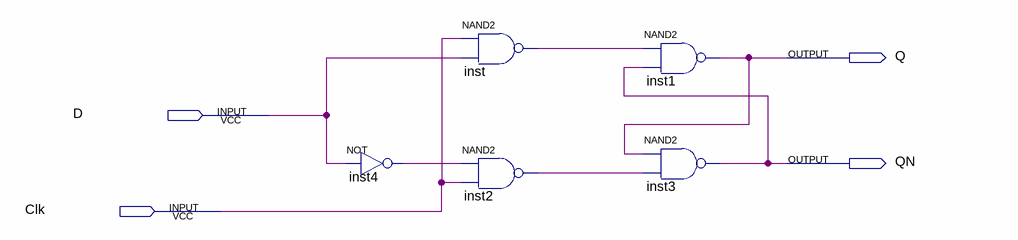
[diagram p0: schematic sheet]
// Quartus schematic GatedDLatch.bdf as structural Verilog: 5 symbols, 4 pins
module GatedDLatch (
  input  D,
  input  Clk,
  output Q,
  output QN
);

  wire inst2_out, inst4_out, inst_out;

  not inst4 (inst4_out, D);
  nand inst (inst_out, Clk, D);
  nand inst2 (inst2_out, inst4_out, Clk);
  nand inst1 (Q, inst_out, QN);
  nand inst3 (QN, Q, inst2_out);
endmodule
